# EAGLE schematic CapstoneControllerBoard V4 (EAGLE 9.2.2)
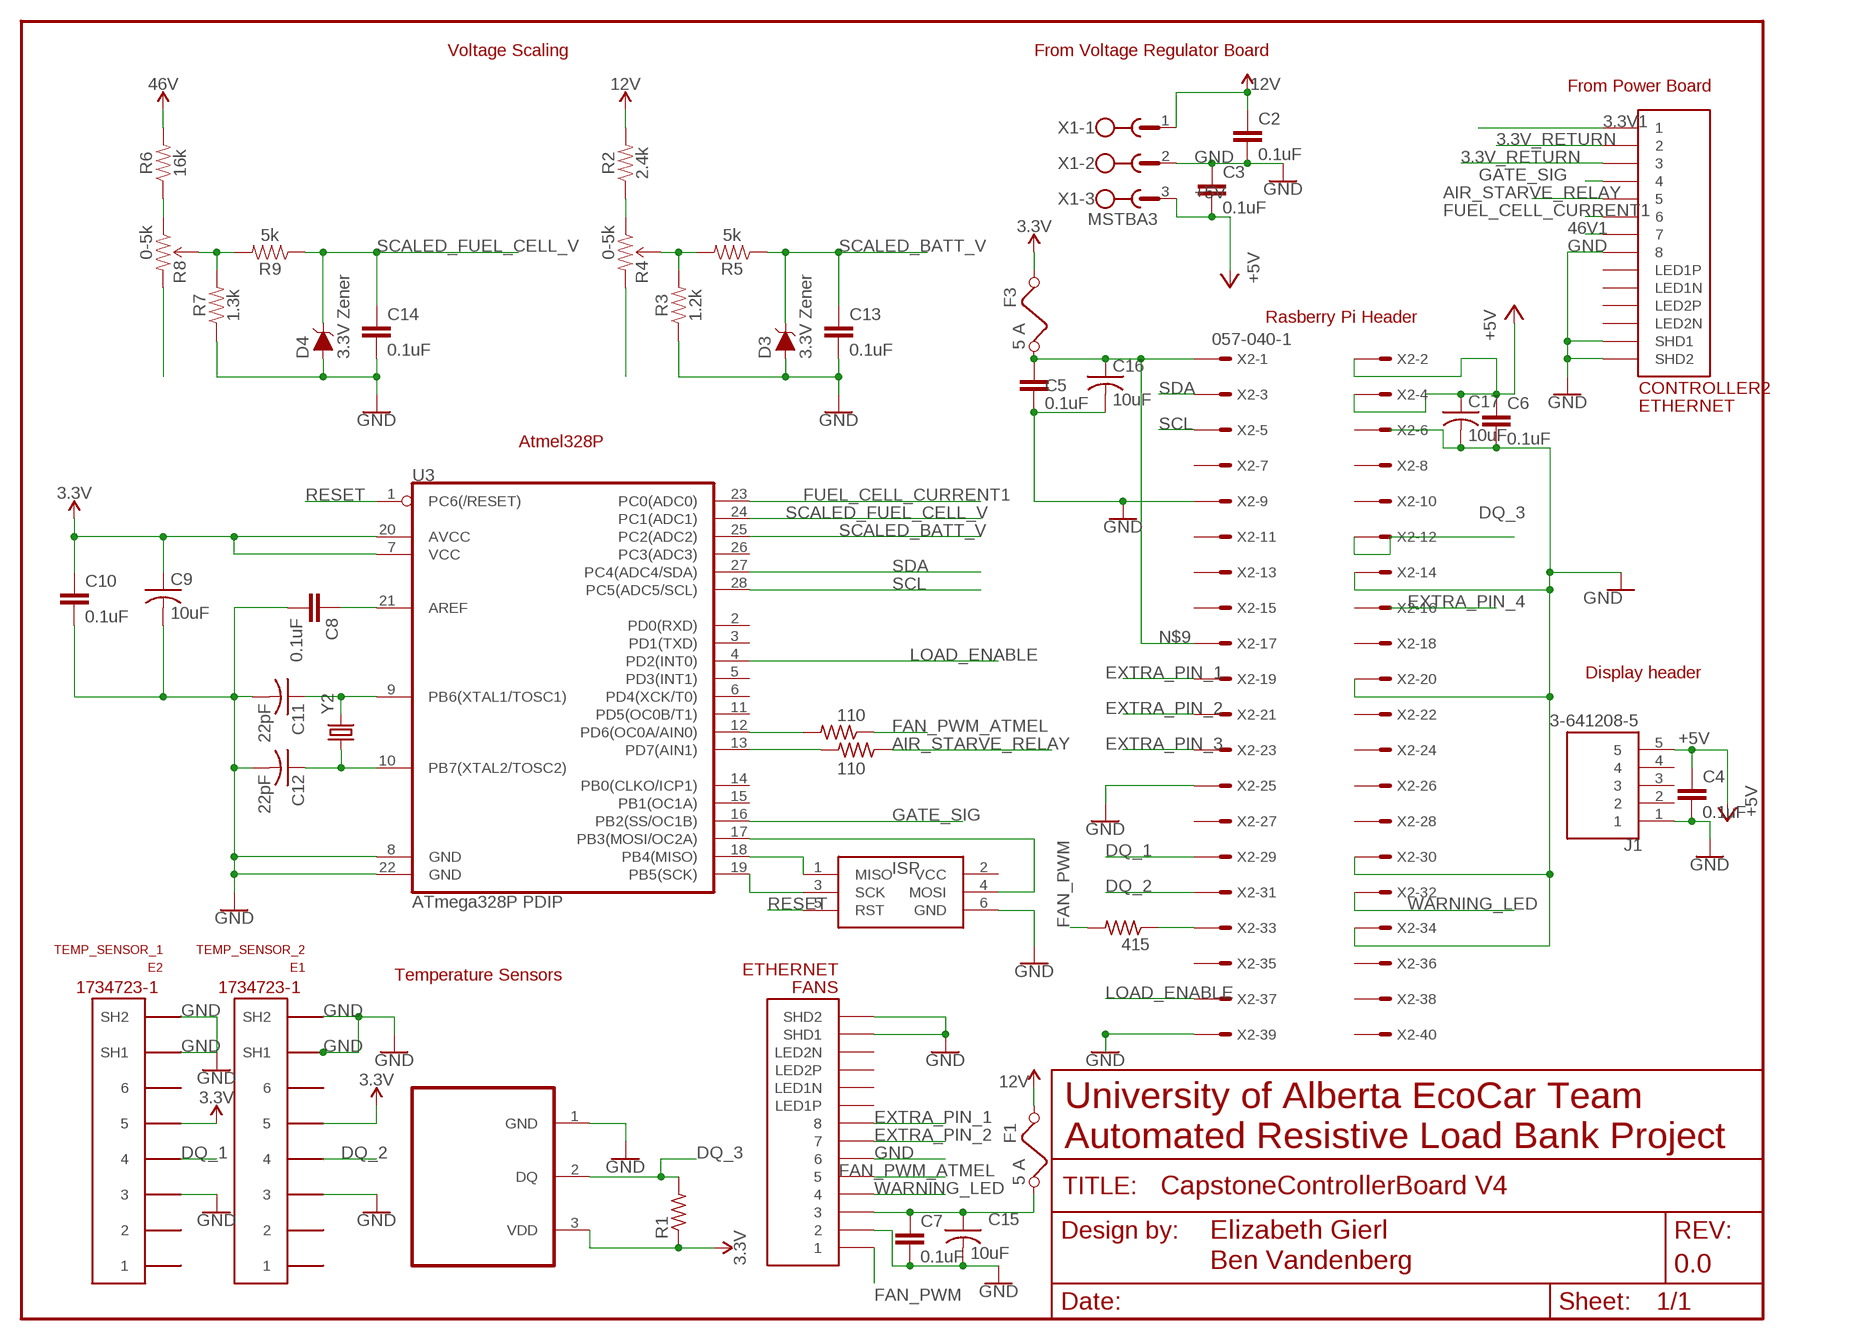
[diagram p0: schematic, sheet 1]

## Parts
1  110  R-US_R0805  [R0805]
2  110  R-US_R0805  [R0805]
415  R-US_R0805  [R0805]
C2  0.1uF  1.0UF-0805-25V-(+80/-20%)  [0805]
C3  0.1uF  1.0UF-0805-25V-(+80/-20%)  [0805]
C4  0.1uF  1.0UF-0805-25V-(+80/-20%)  [0805]
C5  0.1uF  1.0UF-0805-25V-(+80/-20%)  [0805]
C6  0.1uF  1.0UF-0805-25V-(+80/-20%)  [0805]
C7  0.1uF  1.0UF-0805-25V-(+80/-20%)  [0805]
C8  0.1uF  1.0UF-0805-25V-(+80/-20%)  [0805]
C9  10uF  C-USC0603  [C0603]
C10  0.1uF  1.0UF-0805-25V-(+80/-20%)  [0805]
C11  22pF  C-USC0603  [C0603]
C12  22pF  C-USC0603  [C0603]
C13  0.1uF  1.0UF-0805-25V-(+80/-20%)  [0805]
C14  0.1uF  1.0UF-0805-25V-(+80/-20%)  [0805]
C15  10uF  C-USC0603  [C0603]
C16  10uF  C-USC0603  [C0603]
C17  10uF  C-USC0603  [C0603]
CONTROLLER2  ETHERNET  [A122645-ND]
D3  3.3V Zener  SMALL_DIODE  [DO41-7.6]
D4  3.3V Zener  SMALL_DIODE  [DO41-7.6]
E1  TEMP_SENSOR_2  5555140-6  [1734723-1_RJ11]
E2  TEMP_SENSOR_1  5555140-6  [1734723-1_RJ11]
F1  5 A  KEYSTONE_ATM_FUSEHOLDER  [KEYSTONE_ATM_FUSEHOLDER]
F3  5 A  KEYSTONE_ATM_FUSEHOLDER  [KEYSTONE_ATM_FUSEHOLDER]
FANS  ETHERNET  [A122645-ND]
FRAME2  FRAME-LETTERNO_PACKAGE  [DUMMY]
ISP  AVRISP-BOX  [AVRISP-BOX]
J1  3-641208-5  [TE_3-641208-5]
R1  R-US_R0805  [R0805]
R2  2.4k  0.3OHM-0805-1/8W-1%  [0805]
R3  1.2k  0.3OHM-0805-1/8W-1%  [0805]
R4  0-5k  CT6EP502_TRIM_POT  [TRIM_POT]
R5  5k  0.3OHM-0805-1/8W-1%  [0805]
R6  16k  0.3OHM-0805-1/8W-1%  [0805]
R7  1.3k  0.3OHM-0805-1/8W-1%  [0805]
R8  0-5k  CT6EP502_TRIM_POT  [TRIM_POT]
R9  5k  0.3OHM-0805-1/8W-1%  [0805]
U3  ATmega328P PDIP  ATMEGA328P_PDIP  [PDIP-T28]
U$2  DS18B  [TO92]
X1  MSTBA3  [MSTBA3]
X2  057-040-1  [057-040-1]
Y2  CRYSTALHC49US  [HC49US]

## Nets
3.3V: C9.1 C10.1 E1.5 E2.5 F3.L1 F3.L2 U3.7(VCC) U3.20(AVCC)
3.3V1: CONTROLLER2.P$1
3.3V_RETURN: CONTROLLER2.P$2 CONTROLLER2.P$3
12V: C2.1 F1.L1 F1.L2 R2.2 X1.1
46V: R6.2
46V1: CONTROLLER2.P$7
+5V: C3.2 C4.1 C6.1 C17.1 J1.5 X1.3 X2.2 X2.4
AIR_STARVE_RELAY: 2.1 2.2 CONTROLLER2.P$5 U3.13(PD7(AIN1))
DQ_1: E2.4 X2.29
DQ_2: E1.4 X2.31
DQ_3: R1.2 U$2.2(DQ) X2.12
EXTRA_PIN_1: FANS.P$8 X2.19
EXTRA_PIN_2: FANS.P$7 X2.21
EXTRA_PIN_3: X2.23
FAN_PWM: 415.2 FANS.P$1
FAN_PWM_ATMEL: 1.1 FANS.P$5
FUEL_CELL_CURRENT1: CONTROLLER2.P$6 U3.23(PC0(ADC0))
GATE_SIG: CONTROLLER2.P$4 U3.16(PB2(SS/OC1B))
GND: C2.2 C3.1 C4.2 C5.2 C6.2 C7.2 C8.2 C9.2 C10.2 C11.2 C12.2 C13.2 C14.2 C15.2 C16.2 C17.2 CONTROLLER2.P$8 CONTROLLER2.P$13(SHD1) CONTROLLER2.P$14(SHD2) D3.A D4.A E1.3 E1.SH1 E1.SH2 E2.3 E2.SH1 E2.SH2 FANS.P$2 FANS.P$6 FANS.P$13(SHD1) FANS.P$14(SHD2) ISP.6(GND) J1.1 R3.1 R7.1 U3.8(GND) U3.22(GND) U$2.1(GND) X1.2 X2.9 X2.14 X2.20 X2.25 X2.30 X2.34 X2.39
LOAD_ENABLE: U3.4(PD2(INT0)) X2.37
N$1: C8.1 U3.21(AREF)
N$2: ISP.1(MISO) U3.18(PB4(MISO))
N$3: ISP.3(SCK) U3.19(PB5(SCK))
N$4: R8.3(CW)
N$5: R4.3(CW)
N$6: 415.1 X2.33
N$7: R2.1 R4.1(CCW)
N$8: 1.2 U3.12(PD6(OC0A/AIN0))
N$9: C5.1 C16.1 F3.R1 F3.R2 X2.1 X2.17
N$10: R6.1 R8.1(CCW)
N$11: R3.2 R4.2(WIPER) R5.2
N$12: ISP.4(MOSI) U3.17(PB3(MOSI/OC2A))
N$13: C11.1 U3.9(PB6(XTAL1/TOSC1)) Y2.2
N$14: C12.1 U3.10(PB7(XTAL2/TOSC2)) Y2.1
N$15: R7.2 R8.2(WIPER) R9.2
N$16: C7.1 C15.1 F1.R1 F1.R2 FANS.P$3
RESET: ISP.5(RST) U3.1(PC6(/RESET))
SCALED_BATT_V: C13.1 D3.C R5.1 U3.25(PC2(ADC2))
SCALED_FUEL_CELL_V: C14.1 D4.C R9.1 U3.24(PC1(ADC1))
SCL: U3.28(PC5(ADC5/SCL)) X2.5
SDA: U3.27(PC4(ADC4/SDA)) X2.3
VDD: R1.1 U$2.3(VDD) ; supply symbol labelled 3.3V
WARNING_LED: FANS.P$4 X2.32
Unconnected: CONTROLLER2.P$9(LED1N) CONTROLLER2.P$10(LED1P) CONTROLLER2.P$11(LED2N) CONTROLLER2.P$12(LED2P) E1.1 E1.2 E1.6 E2.1 E2.2 E2.6 FANS.P$9(LED1N) FANS.P$10(LED1P) FANS.P$11(LED2N) FANS.P$12(LED2P) J1.2 J1.3 J1.4 U3.2(PD0(RXD)) U3.3(PD1(TXD)) U3.5(PD3(INT1)) U3.6(PD4(XCK/T0)) U3.11(PD5(OC0B/T1)) U3.14(PB0(CLKO/ICP1)) U3.15(PB1(OC1A)) U3.26(PC3(ADC3)) X2.6 X2.7 X2.8 X2.10 X2.11 X2.13 X2.15 X2.16 X2.18 X2.22 X2.24 X2.26 X2.27 X2.28 X2.35 X2.36 X2.38 X2.40

## Notes on the sheet
- Voltage Scaling | From Voltage Regulator Board
- From Power Board
- Rasberry Pi Header
- Atmel328P
- Display header
- Temperature Sensors
- University of Alberta EcoCar Team
  Automated Resistive Load Bank Project
- Elizabeth Gierl

## Power pins joined to a net without a drawn wire
VCC: ISP.2(VCC)

## Library data of the parts
1 2 415 R1 = rcl:R-US_: RESISTOR, American symbol; SPICEPREFIX: R
C2-C8 C10 C13 C14 = SparkFun-Capacitors:1.0UF: 1µF ceramic capacitors A capacitor is a passive two-terminal electrical component used to store electrical energy temporarily in an electric field.; PROD_ID: CAP-11625; VALUE: 1.0uF
C9 C11 C12 C15-C17 = adafruit:C-US: CAPACITOR, American symbol
CONTROLLER2 FANS = ETHERNET-3:ETHERNET: Ethernet port with 2 leds. digikey number A122645-ND
D3 D4 = CustomLibrary:SMALL_DIODE
E1 E2 = 5555140-6 RJ11:5555140-6
F1 F3 = CustomLibrary:KEYSTONE_ATM_FUSEHOLDER; VALUE: ? A
FRAME2 = SparkFun-Aesthetics:FRAME-LETTER: Schematic Frame - Letter Standard 8.5x11 US Letter frame; DESIGNER: Ben Vandenberg; REV: 0.0; VERSION: v01
ISP = adafruit:AVRISP: AVR ISP HEADER Standard 6 pin header for AVR programming
J1 = 3-641208-5:3-641208-5; AVAILABILITY: Unavailable; COMMENT: 3-641208-5; DESCRIPTION: MTA-156 Series, 3.96mm Pitch 5 Way 1 RowStraight PCB Header, Solder Term, 7A; EU_ROHS_COMPLIANCE: Compliant; MF: TE Connectivity; MP: 3-641208-5; PACKAGE: None; PRICE: None; TE_PURCHASE_URL: https://www.te.com/usa-en/product-3-641208-5.html?te_bu=Cor&te_type=disp&te_campaign=seda_glo_cor-seda-global-disp-prtnr-fy19-seda-model-bom-cta_sma-317_1&elqCampaignId=32493
R2 R3 R5-R7 R9 = SparkFun-Resistors:0.3OHM: 0.3Ω resistor A resistor is a passive two-terminal electrical component that implements electrical resistance as a circuit element. Resistors act to reduce current flow, and, at the same time, act to lower voltage levels within circuits. - Wikipedia; PROD_ID: RES-11622; VALUE: 0.3
R4 R8 = CustomLibrary:CT6EP502_TRIM_POT: Trimmer Potentiometer Nidec Copal CT6EP502 5k 0.5W
U3 = CustomLibrary:ATMEGA328P_PDIP
U$2 = temperatureboardElizabeth:DS18B
X1 = con-phoenix-508:MSTBA3: PHOENIX; MF: FARNELL; MPN: 1757255; OC_FARNELL: 3705183; OC_NEWARK: 71C4162
X2 = con-panduit:057-040-: CONNECTOR 40-pin series 057 contact pc board low profile headers; OC_FARNELL: unknown; OC_NEWARK: unknown
Y2 = SparkFun-FreqCtrl:CRYSTAL: Various standard crystals. Proven footprints.